# Altium schematic sheet MT3608 2A.SchDoc
size A
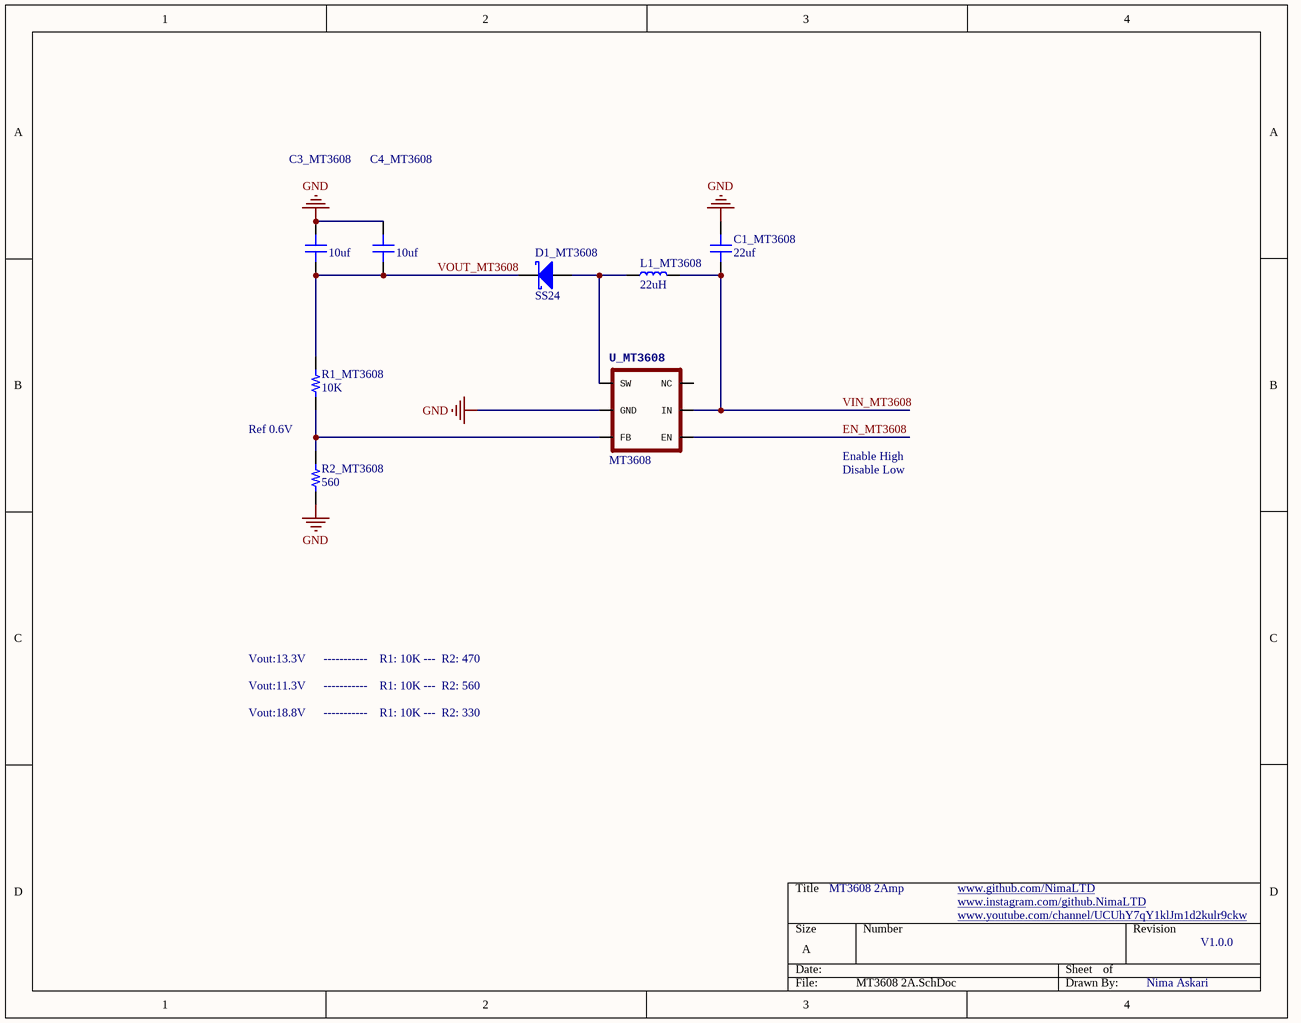
[diagram p0: MT3608 2A.SchDoc]

## Parts
C1_MT3608  22uf  [CAP 1206]
C3_MT3608  10uf  [CAP 1206]
C4_MT3608  10uf  [CAP 1206]
D1_MT3608  Parameter 1: SS24  [DO214AA SMB]  (hidden comment: SS24 SMD)
L1_MT3608  value 22uH  [IND 10X11]  (hidden comment: Inductor SMD POWER 10X11mm)
R1_MT3608  10K  [RES 0805]
R2_MT3608  560  [RES 0805]
U_MT3608  MT3608  [SOT23-6]

## Nets
GND: C1_MT3608.2 C3_MT3608.2 C4_MT3608.2 R2_MT3608.1 U_MT3608.2(GND)
EN_MT3608: U_MT3608.4(EN)
VIN_MT3608: C1_MT3608.1 L1_MT3608.2 U_MT3608.5(IN)
VOUT_MT3608: C3_MT3608.1 C4_MT3608.1 D1_MT3608.2(K) R1_MT3608.2
NetD1_MT3608_1: D1_MT3608.1(A) L1_MT3608.1 U_MT3608.1(SW)
NetR1_MT3608_1: R1_MT3608.1 R2_MT3608.2 U_MT3608.3(FB)

Not connected (* = marked no-connect by the designer): U_MT3608 6(NC)

## Notes on the sheet
- Ref 0.6V
- Enable High
- Disable Low
- Vout:13.3V      -----------    R1: 10K ---  R2: 470
- Vout:11.3V      -----------    R1: 10K ---  R2: 560
- Vout:18.8V      -----------    R1: 10K ---  R2: 330
- MT3608 2Amp
- www.github.com/NimaLTD <http://www.github.com/NimaLTD>
- www.instagram.com/github.NimaLTD <http://www.instagram.com/github.NimaLTD>
- www.youtube.com/channel/UCUhY7qY1klJm1d2kulr9ckw <http://www.youtube.com/channel/UCUhY7qY1klJm1d2kulr9ckw>
- V1.0.0
- Nima Askari

## Library data of the parts
C1_MT3608 C3_MT3608 C4_MT3608 = Cap SMD 1206: SMT Capacitor
  C1_MT3608: Value: 22uf
  C3_MT3608 C4_MT3608: Value: 10uf
D1_MT3608 = SS24 SMD: 2A Schottky
L1_MT3608 = Inductor SMD POWER 10X11mm: SMT Inductor
R1_MT3608 R2_MT3608 = Res SMD 0805: SMD Resistor
  R1_MT3608: Value: 10K
  R2_MT3608: Value: 560
U_MT3608 = MT3608: Boost; Parameter: MT3608